# EAGLE design MB_interactive (EAGLE 9.5.0)
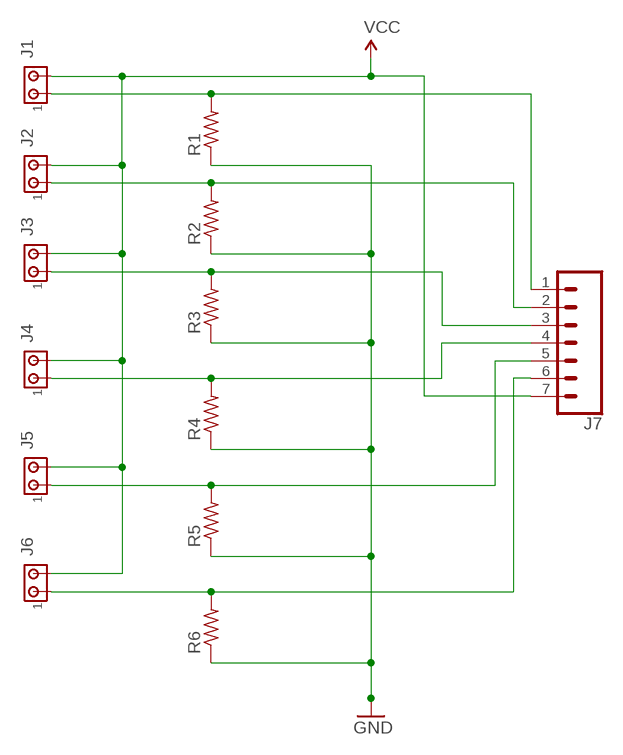
[diagram p0: schematic, sheet 1]

## Parts
J1  MTA02-100  [10X02MTA]
J2  MTA02-100  [10X02MTA]
J3  MTA02-100  [10X02MTA]
J4  MTA02-100  [10X02MTA]
J5  MTA02-100  [10X02MTA]
J6  MTA02-100  [10X02MTA]
J7  CONN_07  [1X07]
R1  R-US_0207/7  [0207/7]
R2  R-US_0207/7  [0207/7]
R3  R-US_0207/7  [0207/7]
R4  R-US_0207/7  [0207/7]
R5  R-US_0207/7  [0207/7]
R6  R-US_0207/7  [0207/7]

## Nets
GND: R1.1 R2.1 R3.1 R4.1 R5.1 R6.1
N$1: J1.1 J7.1 R1.2
N$2: J2.1 J7.2 R2.2
N$3: J3.1 J7.3 R3.2
N$4: J4.1 J7.4 R4.2
N$5: J5.1 J7.5 R5.2
N$6: J6.1 J7.6 R6.2
VCC: J1.2 J2.2 J3.2 J4.2 J5.2 J6.2 J7.7

## Library data of the parts
J1-J6 = con-amp:MTA02-100: AMP connector
J7 = SparkFun-Connectors:CONN_07: Multi connection point. Often used as Generic Header-pin footprint for 0.1 inch spaced/style header connections On any of the 0.1 inch spaced packages, you can populate with these: Break Away Headers - Straight <https://www.sparkfun.com/products/116> (PRT-00116) Break Away Male Headers - Right Angle <https://www.sparkfun.com/products/553> (PRT-00553) Female Headers <https://www.sparkfun.com/products/115> (PRT-00115) Break Away Headers - Machine Pin <https://www.sparkfun.com/products/117> (PRT-00117) Break Away Female Headers - Swiss Machine Pin <https://www.sparkfun.com/products/743> (PRT-00743) For SCREWTERMINALS and SPRING TERMINALS visit here: Screw Terimnals on SparkFun.com <https://www.sparkfun.com/search/results?term=Screw+Terminals> (5mm/3.5mm/2.54mm spacing) This device is also useful as a general connection point to wire up your design to another part of your project. Our various solder wires solder well into these plated through hole pads. Hook-Up Wire - Assortment (Stranded, 22 AWG) <https://www.sparkfun.com/products/11375> (PRT-11375) Hook-Up Wire - Assortment (Solid Core, 22 AWG) <https://www.sparkfun.com/products/11367> (PRT-11367) View the entire wire category on our website here <https://www.sparkfun.com/categories/141> Special notes: Molex polarized connector foot print use with SKU : PRT-08231 with associated crimp pins and housings. 1MM SMD Version SKU: PRT-10208 NOTES ON THE VARIANTS LOCK and LOCK_LONGPADS... This footprint was designed to help hold the alignment of a through-hole component (i.e. 6-pin header) while soldering it into place. You may notice that each hole has been shifted either up or down by 0.005 of an inch from it's more standard position (which is a perfectly straight line). This slight alteration caused the pins (the squares in the middle) to touch the edges of the holes. Because they are alternating, it causes a "brace" to hold the component in place. 0.005 has proven to be the perfect amount of "off-center" position when using our standard breakaway headers. Although looks a little odd when you look at the bare footprint, once you have a header in there, the alteration is very hard to notice. Also,if you push a header all the way into place, it is covered up entirely on the bottom side.
R1-R6 = adafruit:R-US_: RESISTOR, American symbol

## Board
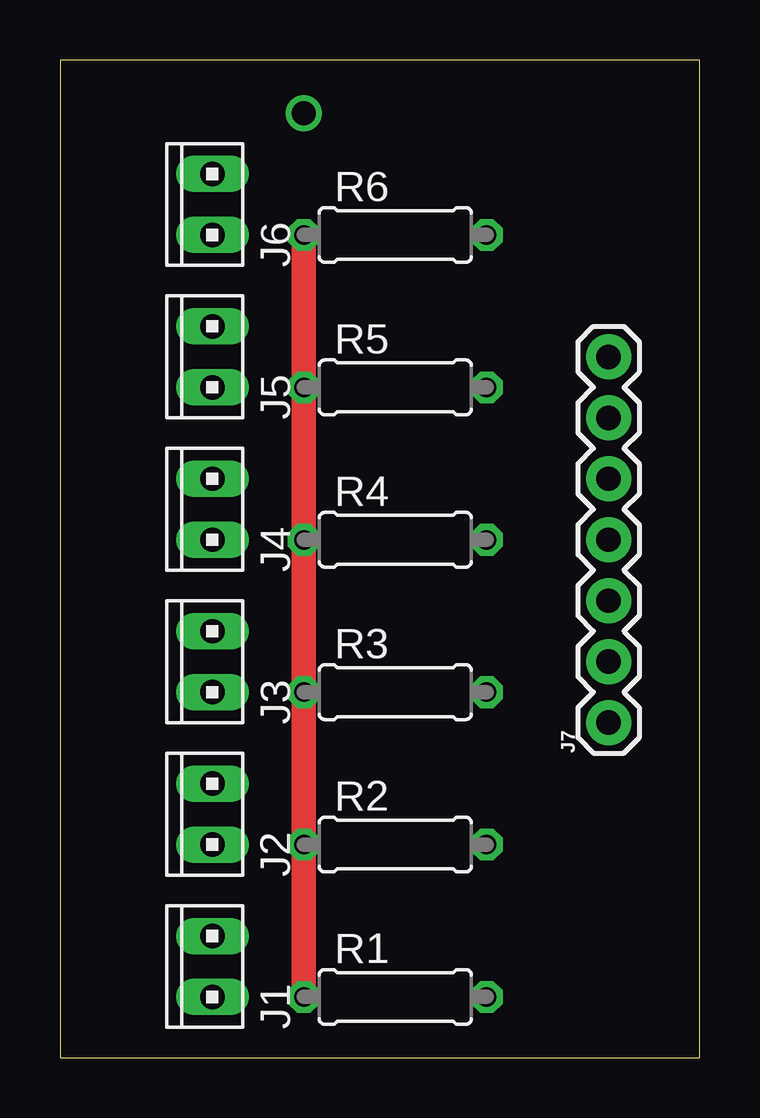
[diagram p1: board, top side]
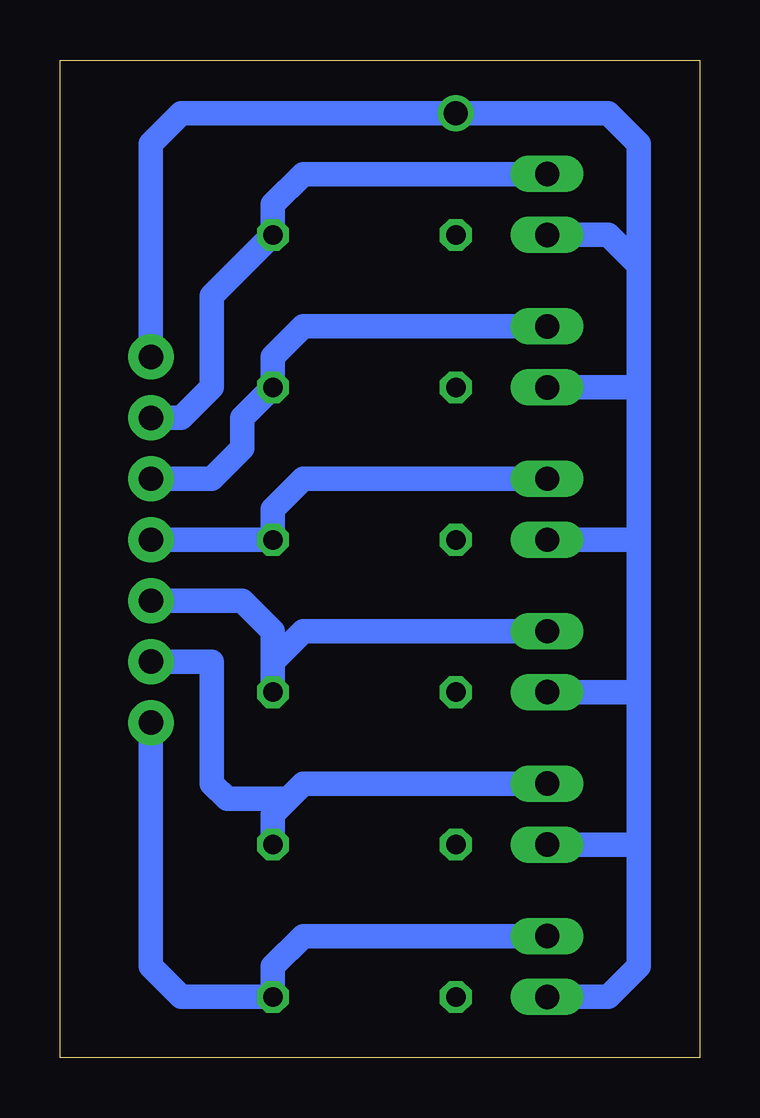
[diagram p2: board, bottom side, seen from below]

Size 26.65 x 41.58 mm. Coordinates in mm from the lower left corner, seen from the top.
Outline: 0,0 26.65,0 26.65,41.58 0,41.58 0,0
Copper layers (1*16): Top 0.035mm / dielectric 1.5mm / Bottom 0.035mm
Design rules "default": minimum track width 6mil, minimum drill 0.35mm, track to track 6mil, track to pad 6mil, pad to pad 6mil, via to via 6mil, smd to smd 6mil, copper to edge 40mil, drill to drill 6mil, minimum pad ring 10mil, minimum via ring 8mil, stop-mask expansion 4mil, vias tented up to drill 0mil, thermal gap 10mil

### Footprints (pad centres in the part's own frame; a part is rotated, then mirrored left to right if it is on the bottom)
10X02MTA = drill 1.016 long: 1 1.27,0; 2 -1.27,0
1X07 = drill 1.016 pad 1.88: 1 0,0; 2 2.54,0; 3 5.08,0; 4 7.62,0; 5 10.16,0; 6 12.7,0; 7 15.24,0
0207/7 = drill 0.813 octagon: 1 -3.81,0; 2 3.81,0

### Placement (x,y rotation side)
J1  6.35,3.81 90 top
J2  6.35,10.16 90 top
J3  6.35,16.51 90 top
J4  6.35,22.86 90 top
J5  6.35,29.21 90 top
J6  6.35,35.56 90 top
J7  22.86,13.97 90 top
R1  13.97,2.54 0 top
R2  13.97,8.89 0 top
R3  13.97,15.24 0 top
R4  13.97,21.59 0 top
R5  13.97,27.94 0 top
R6  13.97,34.29 0 top

### Tracks (layer width: path | path; a pad name or v marks a point on that pad's centre or on a via)
GND
  Top 1.016: R6.1 R5.1 R4.1 R3.1 R2.1 R1.1
N$1
  Bottom 1.016: J1.1 16.51,5.08 17.78,3.81 R1.2 21.59,2.54 22.86,3.81 J7.1
N$2
  Bottom 1.016: J2.1 16.51,11.43 17.14,10.79 | R2.2 17.78,10.16 17.14,10.79 | J7.2 20.32,16.51 20.32,11.43 19.68,10.79 17.14,10.79
N$3
  Bottom 1.016: J3.1 16.51,17.78 17.78,16.51 | 17.78,16.51 R3.2 | J7.3 19.05,19.05 17.78,17.78 17.78,16.51
N$4
  Bottom 1.016: J4.1 16.51,24.13 17.78,22.86 R4.2 J7.4
N$5
  Bottom 1.016: J5.1 16.51,30.48 17.78,29.21 R5.2 19.05,26.67 19.05,25.4 20.32,24.13 J7.5
N$6
  Bottom 1.016: J6.1 16.51,36.83 17.78,35.56 R6.2 20.32,31.75 20.32,27.94 21.59,26.67 J7.6
VCC  (via drill 1)
  Bottom 1.016: J6.2 3.81,34.29 2.54,33.02 | 2.54,33.02 2.54,27.94 | 2.54,27.94 J5.2 | 2.54,27.94 2.54,21.59 | 2.54,21.59 J4.2 | 2.54,21.59 2.54,15.24 | 2.54,15.24 J3.2 | 2.54,15.24 2.54,8.89 | 2.54,8.89 J2.2 | 2.54,8.89 2.54,3.81 3.81,2.54 J1.2 | 2.54,33.02 2.54,38.1 3.81,39.37 v10.16,39.37 20.32,39.37 21.59,39.37 22.86,38.1 22.86,36.83 22.86,35.56 J7.7